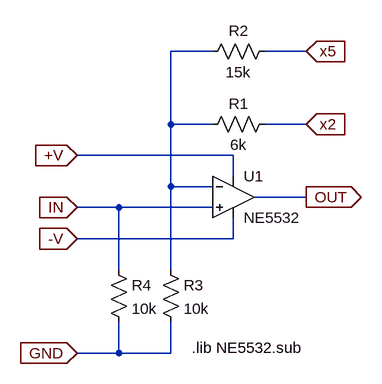
[diagram p0: schematic GS.asc]
GS.asc, the LTspice schematic file:
Version 4
SHEET 1 880 680
WIRE 176 -64 112 -64
WIRE 320 -64 256 -64
WIRE 112 48 112 -64
WIRE 176 48 112 48
WIRE 320 48 256 48
WIRE 208 96 -32 96
WIRE 208 128 208 96
WIRE 112 144 112 48
WIRE 176 144 112 144
WIRE 320 160 240 160
WIRE 32 176 -32 176
WIRE 176 176 32 176
WIRE 208 224 208 192
WIRE 208 224 -32 224
WIRE 32 272 32 176
WIRE 112 272 112 144
WIRE 32 400 32 352
WIRE 32 400 -32 400
WIRE 112 400 112 352
WIRE 112 400 32 400
FLAG -32 176 IN
IOPIN -32 176 In
FLAG -32 96 +V
IOPIN -32 96 In
FLAG -32 224 -V
IOPIN -32 224 In
FLAG -32 400 GND
IOPIN -32 400 In
FLAG 320 48 x2
IOPIN 320 48 In
FLAG 320 -64 x5
IOPIN 320 -64 In
FLAG 320 160 OUT
IOPIN 320 160 Out
SYMBOL res 272 -80 R90
WINDOW 0 0 56 VBottom 2
WINDOW 3 32 56 VTop 2
SYMATTR InstName R2
SYMATTR Value 15k
SYMBOL res 96 256 R0
SYMATTR InstName R3
SYMATTR Value 10k
SYMBOL res 272 32 R90
WINDOW 0 0 56 VBottom 2
WINDOW 3 32 56 VTop 2
SYMATTR InstName R1
SYMATTR Value 6k
SYMBOL OpAmps\\opamp2 208 96 R0
SYMATTR InstName U1
SYMATTR Value NE5532
SYMBOL res 16 256 R0
SYMATTR InstName R4
SYMATTR Value 10k
TEXT 144 392 Left 2 !.lib NE5532.sub

The netlist it stands for:
* GS.asc
R2 x5 N001 15k
R3 N001 GND 10k
R1 x2 N001 6k
XU1 IN N001 +V -V OUT NE5532  ; pins In+ In- V+ V- OUT
R4 IN GND 10k
.lib NE5532.sub
.backanno
.end